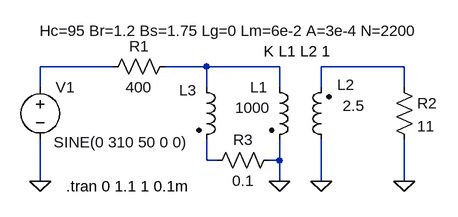
[diagram p0: schematic NL_Trans.asc]
NL_Trans.asc, the LTspice schematic file:
Version 4
SHEET 1 880 680
WIRE -48 64 -160 64
WIRE 96 64 32 64
WIRE 208 64 96 64
WIRE 400 64 272 64
WIRE -160 96 -160 64
WIRE 96 96 96 64
WIRE 208 96 208 64
WIRE 272 96 272 64
WIRE 400 96 400 64
WIRE 96 208 96 176
WIRE 112 208 96 208
WIRE 208 208 208 176
WIRE 208 208 192 208
WIRE -160 240 -160 176
WIRE 208 240 208 208
WIRE 272 240 272 176
WIRE 400 240 400 176
FLAG -160 240 0
FLAG 208 240 0
FLAG 272 240 0
FLAG 400 240 0
SYMBOL ind2 192 80 R0
WINDOW 0 -29 16 Left 0
WINDOW 3 -52 47 Left 0
SYMATTR InstName L1
SYMATTR Value 1000
SYMATTR Type ind
SYMBOL ind2 288 192 R180
WINDOW 0 -36 100 Left 0
WINDOW 3 -51 68 Left 0
SYMATTR InstName L2
SYMATTR Value 2.5
SYMATTR Type ind
SYMBOL res 48 48 R90
WINDOW 0 0 56 VBottom 0
WINDOW 3 32 56 VTop 0
SYMATTR InstName R1
SYMATTR Value 400
SYMBOL res 384 80 R0
SYMATTR InstName R2
SYMATTR Value 11
SYMBOL voltage -160 80 R0
WINDOW 3 21 100 Left 0
WINDOW 123 0 0 Left 0
WINDOW 39 0 0 Left 0
SYMATTR Value SINE(0 310 50 0 0)
SYMATTR InstName V1
SYMBOL ind2 80 80 R0
WINDOW 3 -241 -71 Left 0
WINDOW 0 -26 20 Left 0
SYMATTR Value Hc=95 Br=1.2 Bs=1.75 Lg=0 Lm=6e-2 A=3e-4 N=2200
SYMATTR InstName L3
SYMATTR Type ind
SYMBOL res 208 192 R90
WINDOW 0 0 56 VBottom 0
WINDOW 3 32 56 VTop 0
SYMATTR InstName R3
SYMATTR Value 0.1
TEXT -120 248 Left 0 !.tran 0 1.1 1 0.1m
TEXT 184 40 Left 0 !K L1 L2 1

The netlist it stands for:
* NL_Trans.asc
L1 N002 0 1000
L2 0 N003 2.5
R1 N002 N001 400
R2 N003 0 11
V1 N001 0 SINE(0 310 50 0 0)
L3 N002 N004 Hc=95 Br=1.2 Bs=1.75 Lg=0 Lm=6e-2 A=3e-4 N=2200
R3 0 N004 0.1
.tran 0 1.1 1 0.1m
K L1 L2 1
.backanno
.end